# EAGLE design SHY-BOTTOM (EAGLE 9.5.1)
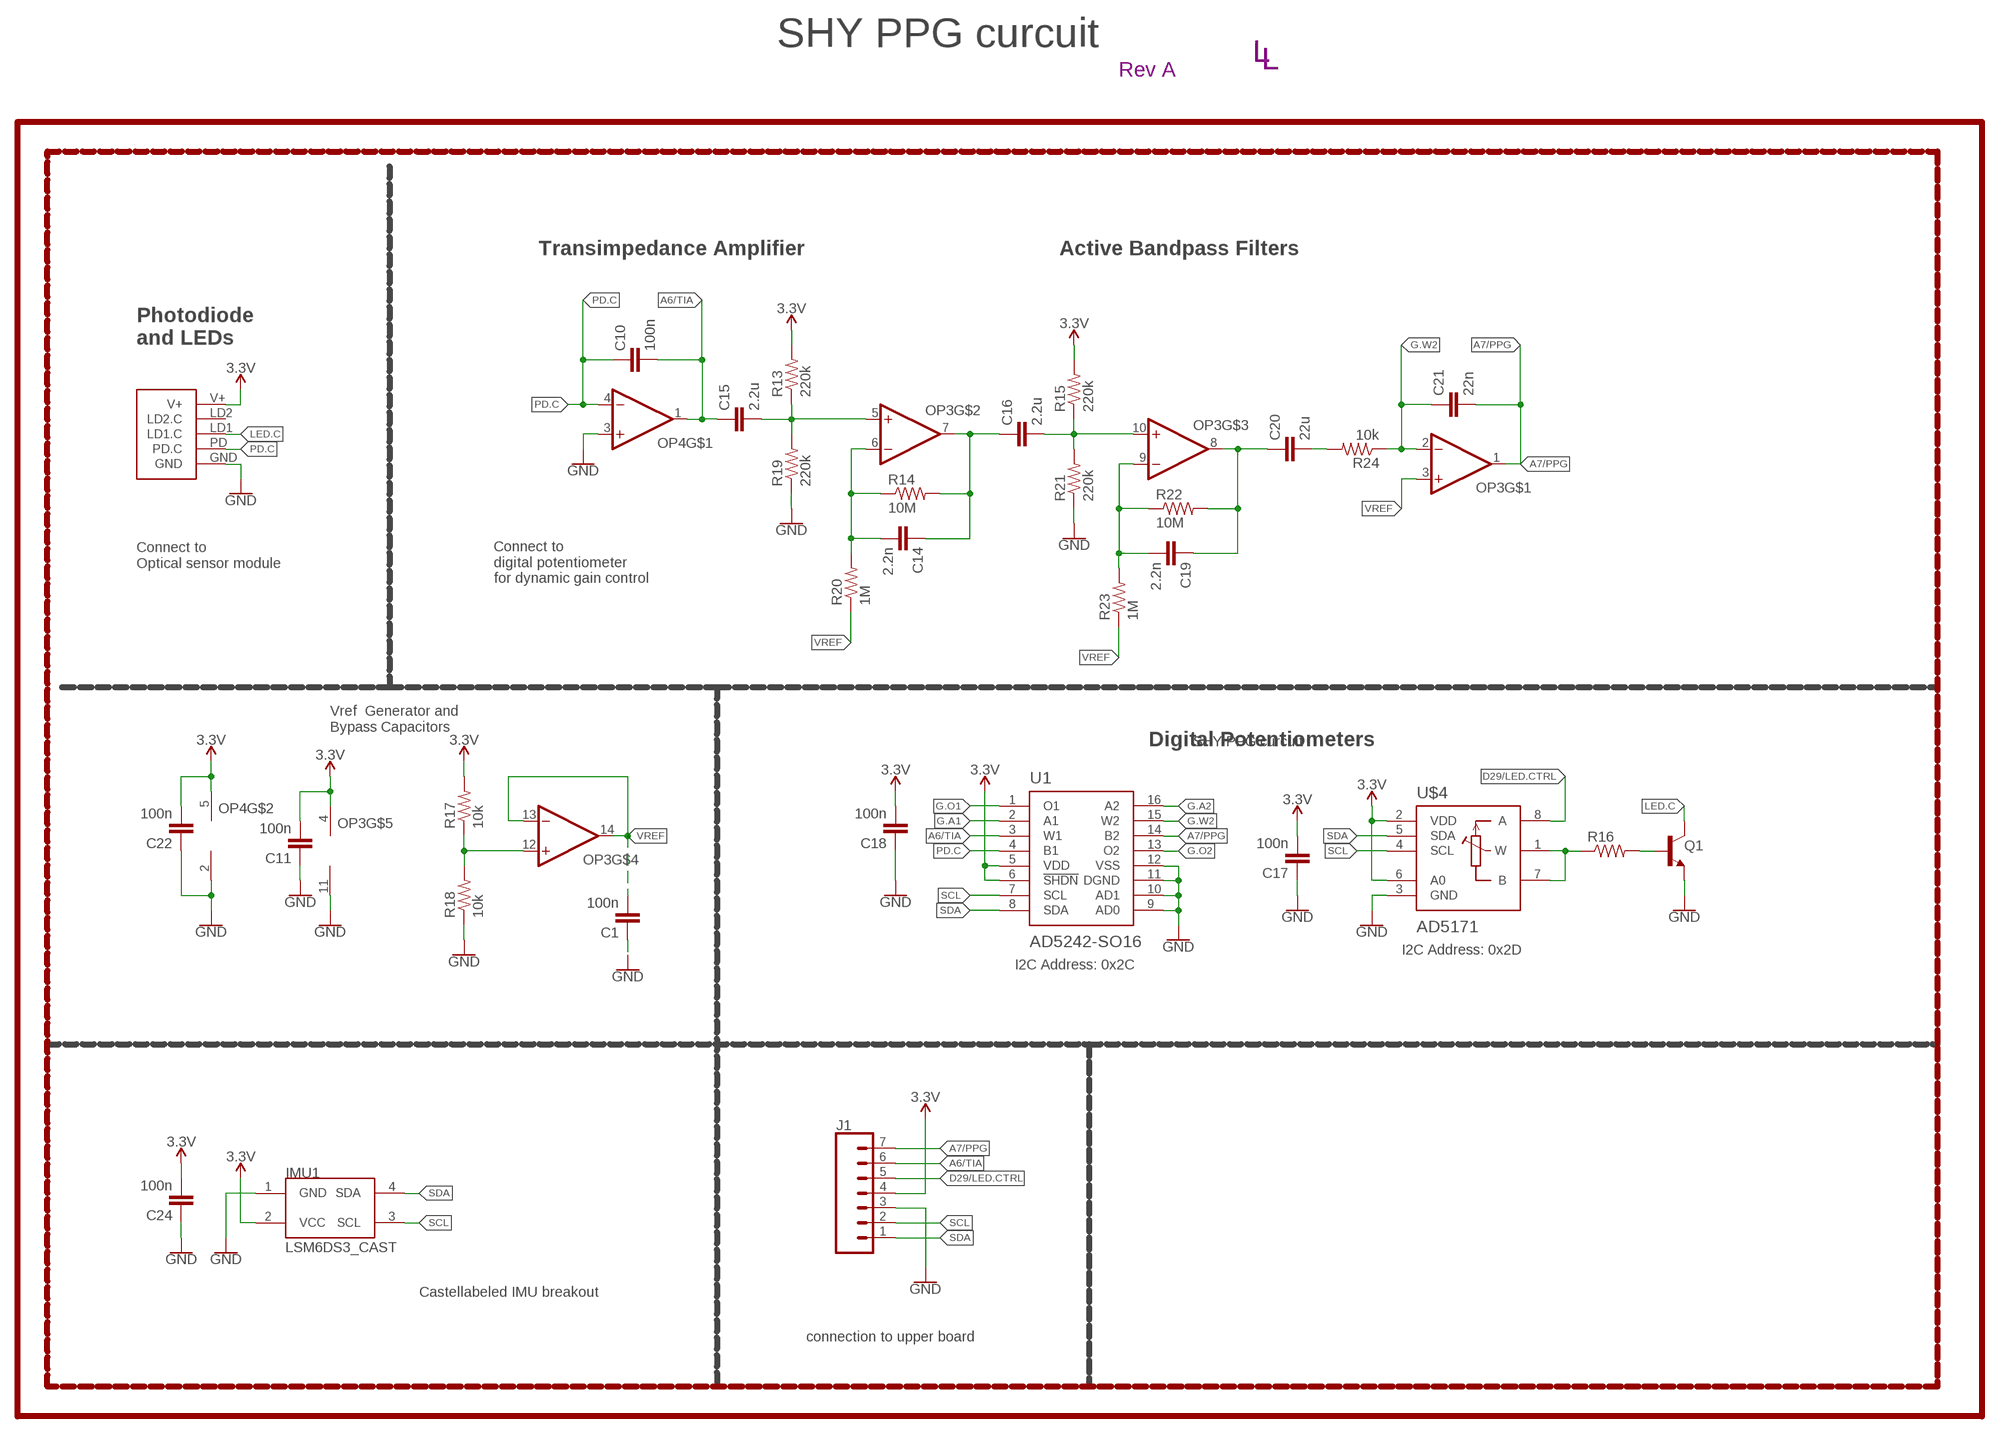
[diagram p0: schematic, sheet 1]

## Parts
C1  100n  CAPACITOR0603  [C0603]
C10  100n  CAPACITOR0603  [C0603]
C11  100n  CAPACITOR0603  [C0603]
C14  2.2n  CAPACITOR0603  [C0603]
C15  2.2u  CAPACITOR0603  [C0603]
C16  2.2u  CAPACITOR0603  [C0603]
C17  100n  CAPACITOR0603  [C0603]
C18  100n  CAPACITOR0603  [C0603]
C19  2.2n  CAPACITOR0603  [C0603]
C20  22u  CAPACITOR0603  [C0603]
C21  22n  CAPACITOR0603  [C0603]
C22  100n  CAPACITOR0603  [C0603]
C24  100n  CAPACITOR0603  [C0603]
IMU1  LSM6DS3_CAST  [LSM6DS3_CAST]
J1  CONN_07-1.27MM  [1X07_1.27MM]
LOGO1  REVISION.A  [REV.A]
LOGO2  LINNES.LAB.LOGO  [LINNES.LAB.LOGO]
OP3  OP-QUAD-SO14  [SO14]
OP4  OP-SINGLEOT  [SOT23-5]
Q1  NPN-GENERIC  [SOT23-3]
R13  220k  RESISTOR0603  [R0603]
R14  10M  RESISTOR0603  [R0603]
R15  220k  RESISTOR0603  [R0603]
R16  RESISTOR0603  [R0603]
R17  10k  RESISTOR0402  [R0402]
R18  10k  RESISTOR0402  [R0402]
R19  220k  RESISTOR0603  [R0603]
R20  1M  RESISTOR0603  [R0603]
R21  220k  RESISTOR0603  [R0603]
R22  10M  RESISTOR0603  [R0603]
R23  1M  RESISTOR0603  [R0603]
R24  10k  RESISTOR0603  [R0603]
U1  AD5242-SO16  [SO16]
U$3  PPG.MODULE.2  [PPG.MODULE.2]
U$4  AD5171  [SOT-23-8]

## Nets
3.3V: C11.2 C17.2 C18.2 C22.2 C24.2 IMU1.2(VCC) J1.4 OP3.4(V+) OP4.5(V+) R13.2 R15.2 R17.2 U1.5(VDD) U1.6(!SHDN) U$3.V+ U$4.2(VDD) U$4.6(A0)
A6/TIA: C10.2 C15.1 J1.6 OP4.1(OUT) U1.3(W1)
A7/PPG: C21.2 J1.7 OP3.1(OUT) U1.14(B2)
D29/LED.CTRL: J1.5 U$4.8(A)
G.A1: U1.2(A1)
G.A2: U1.16(A2)
G.O1: U1.1(O1)
G.O2: U1.13(O2)
G.W2: C21.1 OP3.2(-IN) R24.1 U1.15(W2)
GND: C1.1 C11.1 C17.1 C18.1 C22.1 C24.1 IMU1.1(GND) J1.3 OP3.11(V-) OP4.2(V-) OP4.3(+IN) Q1.2(E) R18.1 R19.1 R21.1 U1.9(AD0) U1.10(AD1) U1.11(DGND) U1.12(VSS) U$3.GND U$4.3(GND)
LED.C: Q1.3(C) U$3.LD1(LD1.C)
N$8: Q1.1(B) R16.2
N$9: R16.1 U$4.1(W) U$4.7(B)
N$10: OP3.12(+IN) R17.1 R18.2
N$13: C15.2 OP3.5(+IN) R13.1 R19.2
N$15: C14.2 OP3.6(-IN) R14.1 R20.2
N$16: C14.1 C16.1 OP3.7(OUT) R14.2
N$17: C16.2 OP3.10(+IN) R15.1 R21.2
N$18: C19.2 OP3.9(-IN) R22.1 R23.2
N$19: C19.1 C20.1 OP3.8(OUT) R22.2
N$20: C20.2 R24.2
PD.C: C10.1 OP4.4(-IN) U1.4(B1) U$3.PD(PD.C)
SCL: IMU1.3(SCL) J1.2 U1.7(SCL) U$4.4(SCL)
SDA: IMU1.4(SDA) J1.1 U1.8(SDA) U$4.5(SDA)
VREF: C1.2 OP3.3(+IN) OP3.13(-IN) OP3.14(OUT) R20.1 R23.1
Unconnected: U$3.LD2(LD2.C)

## Notes on the sheet
- SHY PPG curcuit
- Transimpedance Amplifier | Active Bandpass Filters
- Photodiode
  and LEDs
- Connect to 
  Optical sensor module
- Connect to 
  digital potentiometer
  for dynamic gain control
- Vref  Generator and 
  Bypass Capacitors
- Digital Potentiometers | SHY PPG curcuit
- I2C Address: 0x2D
- I2C Address: 0x2C
- Castellabeled IMU breakout
- connection to upper board

## Library data of the parts
C1 C10 C11 C14-C22 C24 = LinnesLab-Passives:CAPACITOR
IMU1 = LinnesLab-Sensors:LSM6DS3_CAST
J1 = LinnesLab-Connectors:CONN_07: Multi connection point. Often used as Generic Header-pin footprint for 0.1 inch spaced/style header connections On any of the 0.1 inch spaced packages, you can populate with these: Break Away Headers - Straight <https://www.sparkfun.com/products/116> (PRT-00116) Break Away Male Headers - Right Angle <https://www.sparkfun.com/products/553> (PRT-00553) Female Headers <https://www.sparkfun.com/products/115> (PRT-00115) Break Away Headers - Machine Pin <https://www.sparkfun.com/products/117> (PRT-00117) Break Away Female Headers - Swiss Machine Pin <https://www.sparkfun.com/products/743> (PRT-00743) For SCREWTERMINALS and SPRING TERMINALS visit here: Screw Terimnals on SparkFun.com <https://www.sparkfun.com/search/results?term=Screw+Terminals> (5mm/3.5mm/2.54mm spacing) This device is also useful as a general connection point to wire up your design to another part of your project. Our various solder wires solder well into these plated through hole pads. Hook-Up Wire - Assortment (Stranded, 22 AWG) <https://www.sparkfun.com/products/11375> (PRT-11375) Hook-Up Wire - Assortment (Solid Core, 22 AWG) <https://www.sparkfun.com/products/11367> (PRT-11367) View the entire wire category on our website here <https://www.sparkfun.com/categories/141> Special notes: Molex polarized connector foot print use with SKU : PRT-08231 with associated crimp pins and housings. 1MM SMD Version SKU: PRT-10208 NOTES ON THE VARIANTS LOCK and LOCK_LONGPADS... This footprint was designed to help hold the alignment of a through-hole component (i.e. 6-pin header) while soldering it into place. You may notice that each hole has been shifted either up or down by 0.005 of an inch from it's more standard position (which is a perfectly straight line). This slight alteration caused the pins (the squares in the middle) to touch the edges of the holes. Because they are alternating, it causes a "brace" to hold the component in place. 0.005 has proven to be the perfect amount of "off-center" position when using our standard breakaway headers. Although looks a little odd when you look at the bare footprint, once you have a header in there, the alteration is very hard to notice. Also,if you push a header all the way into place, it is covered up entirely on the bottom side.
LOGO1 = LinnesLab-Logos:REVISION.A
LOGO2 = LinnesLab-Logos:LINNES.LAB.LOGO
OP3 = LinnesLab-AnalogIC:OP-QUAD: General symbol and footprints for Quad Op Amps. Use with any standard general purpose op amp.
OP4 = LinnesLab-AnalogIC:OP-SINGLE: Single Op Amp 2.7V to 6.0V Single Supply CMOS Source: http://ww1.microchip.com/downloads/en/DeviceDoc/21314g.pdf
Q1 = LinnesLab-DiscreteSemi:NPN
R13-R24 = LinnesLab-Passives:RESISTOR
U1 = LinnesLab-DigitalIC:AD5242
U$3 = LinnesLab-Connectors:PPG.MODULE.2: Digi-Key Part Number: S9014E-50-ND Manufacturer Part Number: GRPB501VWVN-RC Description: 1mm insulation height 0.05in pitch 50 positions
U$4 = LinnesLab-DigitalIC:AD5171

## Board
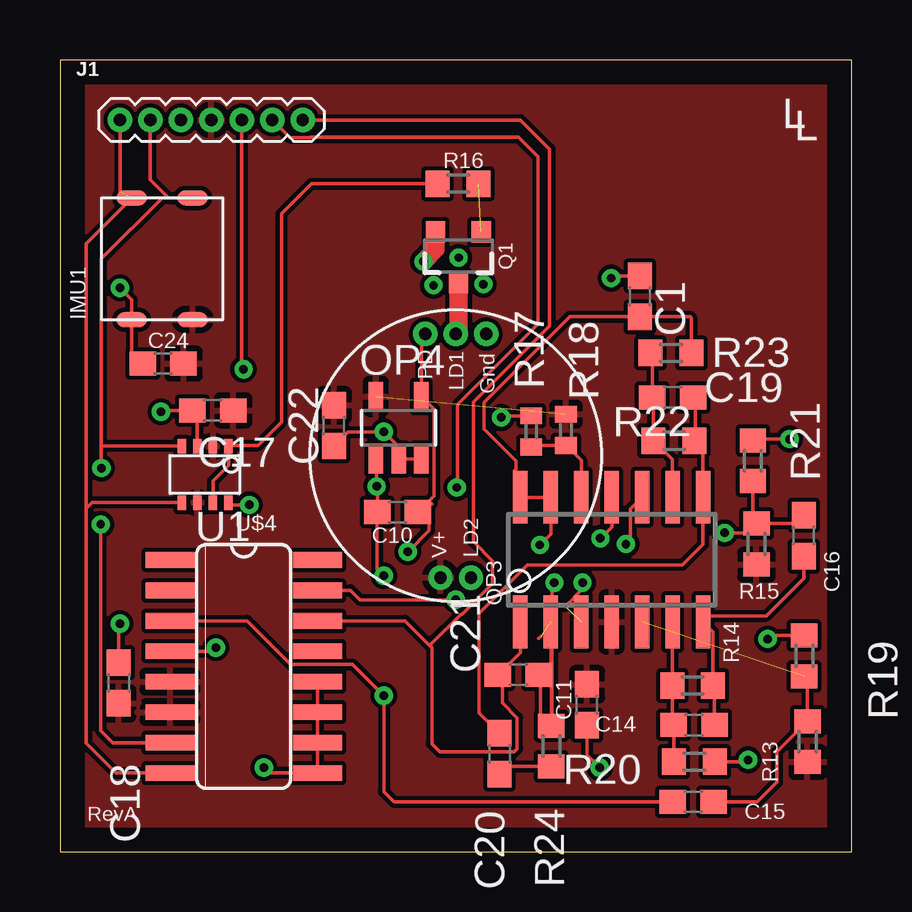
[diagram p1: board, top side]
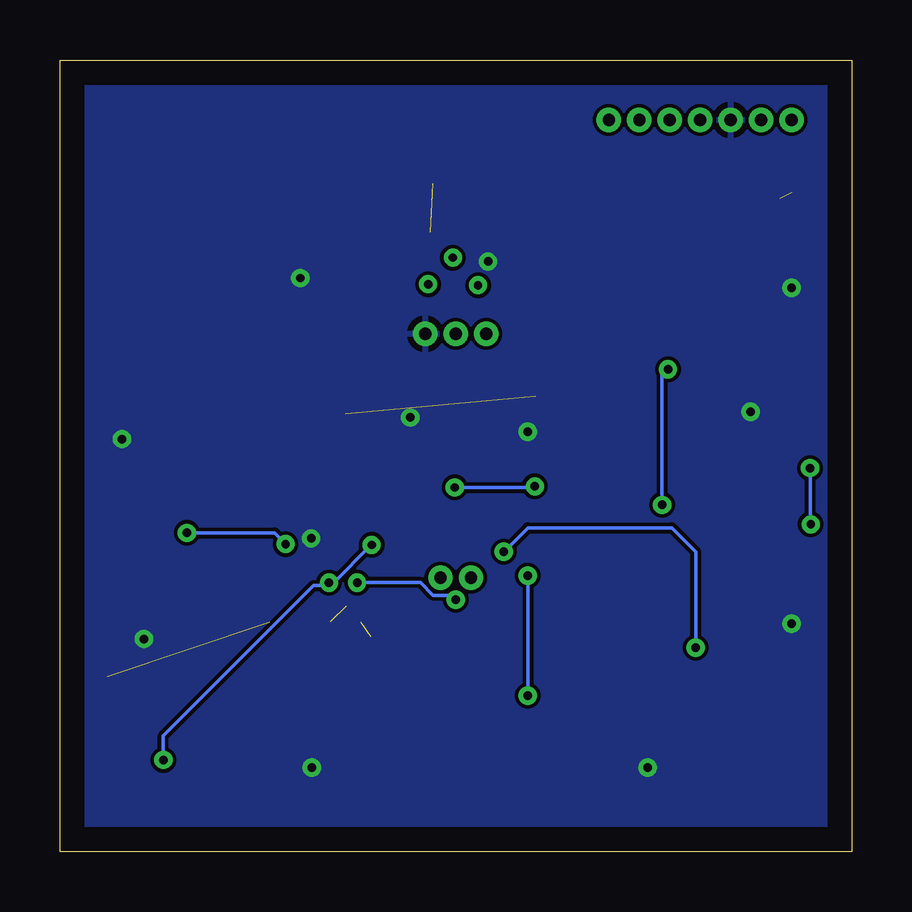
[diagram p2: board, bottom side, seen from below]

Size 33 x 33 mm. Coordinates in mm from the lower left corner, seen from the top.
Outline: 0,0 33,0 33,33 0,33 0,0
Copper layers (1*16): Top 0.035mm / dielectric 1.5mm / Bottom 0.035mm
Design rules "default": minimum track width 6mil, minimum drill 0.35mm, track to track 6mil, track to pad 6mil, pad to pad 6mil, via to via 6mil, smd to smd 6mil, copper to edge 40mil, drill to drill 6mil, minimum pad ring 10mil, minimum via ring 8mil, stop-mask expansion 4mil, vias tented up to drill 0mil, thermal gap 10mil

### Footprints (pad centres in the part's own frame; a part is rotated, then mirrored left to right if it is on the bottom)
C0603 = smd 1.1 x 1: 1 -0.85,0; 2 0.85,0
LSM6DS3_CAST = smd 0.635 x 1.27: 1 -2.54,1.27; 2 -2.54,-1.27; 3 2.54,-1.27; 4 2.54,1.27
1X07_1.27MM = drill 0.508 pad 1: 1 0,0; 2 1.27,0; 3 2.54,0; 4 3.81,0; 5 5.08,0; 6 6.35,0; 7 7.62,0
SO14 = smd 0.6 x 2.2: 1 -3.81,-2.6; 2 -2.54,-2.6; 3 -1.27,-2.6; 4 0,-2.6; 5 1.27,-2.6; 6 2.54,-2.6; 7 3.81,-2.6; 8 3.81,2.6; 9 2.54,2.6; 10 1.27,2.6; 11 0,2.6; 12 -1.27,2.6; 13 -2.54,2.6; 14 -3.81,2.6
SOT23-5 = smd 0.6 x 1.2: 1 -0.95,-1.306; 2 0,-1.306; 3 0.95,-1.306; 4 0.95,1.306; 5 -0.95,1.306
SOT23-3 = smd 0.8 x 0.9: 1 -0.95,-1; 2 0.95,-1; 3 0,1.1
R0603 = smd 1 x 1.1: 1 -0.85,0; 2 0.85,0
R0402 = smd 0.7 x 0.9: 1 -0.65,0; 2 0.65,0
SO16 = smd 0.66 x 2.032: 1 -4.445,-3.073; 2 -3.175,-3.073; 3 -1.905,-3.073; 4 -0.635,-3.073; 5 0.635,-3.073; 6 1.905,-3.073; 7 3.175,-3.073; 8 4.445,-3.073; 9 4.445,3.073; 10 3.175,3.073; 11 1.905,3.073; 12 0.635,3.073; 13 -0.635,3.073; 14 -1.905,3.073; 15 -3.175,3.073; 16 -4.445,3.073
PPG.MODULE.2 = drill 0.508 pad 0.94: GND 1.27,5.08; LD1 0,5.08; LD2 0.635,-5.08; PD -1.27,5.08; V+ -0.635,-5.08
SOT-23-8 = smd 0.35 x 0.6: 1 -0.991,-1.176; 2 -0.341,-1.176; 3 0.309,-1.176; 4 0.959,-1.176; 5 0.959,1.176; 6 0.309,1.176; 7 -0.341,1.176; 8 -0.991,1.176

### Placement (x,y rotation side)
C1  24.17,23.15 270 top
C10  14.07,14.15 180 top
C11  21.97,6.13 90 top
C14  26.43,5.28 180 top
C15  26.4,2.07 0 top
C16  31,13.17 90 top
C17  6.37,18.39 0 top
C18  2.44,7.03 270 top
C19  25.55,18.94 180 top
C20  18.33,4.08 270 top
C21  19.11,7.37 180 top
C22  11.42,17.76 90 top
C24  4.3,20.34 0 top
IMU1  4.26,24.71 90 top
J1  2.5,30.5 0 top
LOGO1  1.14,1.27 0 top
LOGO2  30.1,30.14 0 top
OP3  23,12.17 0 top
OP4  14.12,17.67 0 top
Q1  16.61,24.83 180 top
R13  31.17,4.59 270 top
R14  26.37,6.92 0 top
R15  29.04,12.82 270 top
R16  16.6,27.84 0 top
R17  21.09,17.58 90 top
R18  19.65,17.51 270 top
R19  31.02,8.16 270 top
R20  26.44,3.74 180 top
R21  28.89,16.29 270 top
R22  25.6,17.12 0 top
R23  25.47,20.79 180 top
R24  20.49,4.4 270 top
U1  7.66,7.72 270 top
U$3  16.5,16.5 0 top
U$4  6.04,15.72 180 top

### Tracks (layer width: path | path; a pad name or v marks a point on that pad's centre or on a via)
3.3V  (1 unrouted)
  Top 0.152: 3.59,5.81 U1.6
  pour Top (isolate 0.178): 1.03,32.12 32.09,32.12 32.09,0.88 0.88,0.88 0.88,32.2
A6/TIA  (via drill 0.35)
  Top 0.152: OP4.1 13.2,16.33 v13.2,15.22 13.24,15.18 13.24,14.17 C10.2 13.22,11.78 v13.5,11.5 | C15.1 13.93,2.07 13.5,2.5 v13.5,6.5 12.21,7.79 9.62,7.79 7.8,9.62 U1.3 | v16.54,15.18 16.57,15.21 16.57,18.63 19.94,21.99 19.94,28.96 19.11,29.79 10.45,29.79 10.43,29.76 9.59,29.76 J1.6
  Bottom 0.152: v13.5,11.5 v13.5,6.5 | v16.54,15.18 13.25,15.18 v13.2,15.22
A7/PPG
  Top 0.152: OP3.1 19.19,8.31 18.44,7.56 | 18.44,7.56 C21.2 | 11.38,9.62 U1.14 14.38,9.62 15.47,8.53 | 18.44,7.56 18.44,6.19 19.06,5.58 19.06,4.29 18.92,4.15 15.85,4.15 15.5,4.5 15.5,8.5 15.47,8.53 | J1.7 19.19,30.5 20.41,29.29 20.41,21.9 17.24,18.73 17.24,12.93 18.04,12.12 18.04,11.18 16.75,9.89 16.71,9.89 15.47,8.65 15.47,8.53
D29/LED.CTRL  (via drill 0.35)
  Top 0.152: J1.5 7.58,20.17 v7.65,20.1 | v7.9,14.45 7.12,14.45 U$4.8
  Bottom 0.152: v7.65,20.1 7.9,19.86 v7.9,14.45
G.W2  (via drill 0.35)  (1 unrouted)
  Top 0.152: 19.96,8.89 20.04,8.97 | 20.46,9.74 OP3.2 20.46,7.88 C21.1 | C21.1 20.03,7.44 20.03,4.76 20.5,5.24 20.5,11.1 v20.61,11.21 | C21.1 20.49,6.84 R24.1 | 11.11,10.89 U1.15 12.11,10.89 12.5,10.5 v16.5,10.5
  Bottom 0.152: v20.61,11.21 17.97,11.21 17.44,10.68 16.68,10.68 v16.5,10.5
GND  (via drill 0.35)
  Top 0.152: R18.1 18.39,18.16 v18.39,18.1 | OP3.11 23,13.53 v22.52,13.06 | v30.42,17.2 29.35,17.2 29.29,17.14 R21.1 | v29.5,8.86 29.65,9.01 R19.1 | C11.1 21.97,4.03 v22.5,3.5 | C22.1 12.02,17.5 v13.5,17.5 14.12,16.88 OP4.2 OP4.3 | U1.12 U1.11 U1.10 U1.9 8.73,3.27 v8.5,3.5 | v2.5,9.5 2.44,9.44 C18.1 | v2.5,23.5 2.99,23.01 IMU1.1 2.99,20.8 C24.1 | U$4.3 5.73,18.18 C17.1 4.27,18.39 v4.21,18.33 | C1.1 23.07,24 v22.98,23.91
  Top 0.762: Q1.2 15.66,25.11 v15.15,24.6
  pour Bottom: 0.8,32.23 32.2,32.23 32.2,0.82 0.8,0.82
LED.C
  Top 0.762: Q1.3 16.61,21.69 U$3.LD1
N$3  (via drill 0.35)
  other vias: 15.57,23.61
N$4  (via drill 0.35)
  other vias: 16.62,24.76
N$5  (via drill 0.35)
  other vias: 17.65,23.65
N$8  (1 unrouted)
N$9
  Top 0.152: R16.1 10.48,27.84 9.23,26.59 9.23,17.91 8.26,16.93 7.06,16.93 U$4.1 7.03,16.09 6.38,15.44 U$4.7
N$10
  Top 0.152: R18.2 19.72,16.93 R17.1 21.73,16.29 OP3.12
N$13  (1 unrouted)
  Top 0.152: R19.2 31.17,7.16 R13.1 29.89,4.16 29.89,2.89 29.07,2.07 C15.2
N$15
  Top 0.152: OP3.6 25.52,9.55 R14.1 25.52,5.34 C14.2 25.59,5.26 R20.2
N$16
  Top 0.152: C14.1 27.28,6.86 R14.2 27.22,9.16 OP3.7 27.07,9.83 29.44,9.83 31,11.39 C16.1
N$17  (via drill 0.35)
  Top 0.152: R15.1 28.64,13.27 v27.7,13.27 | v27.7,13.27 27.67,13.27 | v27.7,13.27 v27.71,13.28 | v23.59,12.82 23.78,13.01 23.78,14.28 OP3.10 | C16.2 30.65,13.67 R15.1 | R21.2 28.89,13.82 R15.1
  Bottom 0.152: v27.71,13.28 24.06,13.28 v23.59,12.82
N$18
  Top 0.152: OP3.9 25.54,16.33 R22.1 24.75,18.88 C19.2 24.7,20.71 R23.2
N$19
  Top 0.152: C19.1 26.5,18.83 26.5,17.18 R22.2 26.81,16.76 OP3.8 26.81,12.81 25.95,11.96 19.5,11.96 17.48,9.93 17.48,5.78 C20.1
N$20
  Top 0.152: C20.2 18.64,3.55 R24.2
PD.C  (via drill 0.35)
  Top 0.152: U$3.PD 15.07,21.42 OP4.4 15.59,18.45 15.59,14.82 15.39,14.61 | 15.5,14.5 15.27,14.5 C10.1 15.39,14.61 | U1.4 6.35,8.35 v6.5,8.5 | v14.5,12.5 15.39,13.39 15.39,14.61
  Bottom 0.152: v6.5,8.5 6.5,12.5 7.5,13.5 13.5,13.5 v14.5,12.5
SCL  (via drill 0.35)
  Top 0.152: J1.2 3.77,28.01 4.53,27.25 IMU1.3 4.26,27.25 1.73,24.72 1.73,16.92 | U1.7 2.19,4.54 1.7,5.03 v1.7,13.64 | v1.73,15.99 1.73,16.92 | U$4.4 1.75,16.9 1.73,16.92
  Bottom 0.152: v1.7,13.64 1.73,13.67 v1.73,15.99
SDA  (1 unrouted)
  Top 0.152: J1.1 2.5,27.5 | IMU1.4 1.09,25.35 1.09,14.3 | 1.09,14.3 1.09,4.5 2.33,3.27 U1.8 | U$4.5 1.34,14.54 1.09,14.3
VREF  (via drill 0.35)  (1 unrouted)
  Top 0.152: OP3.14 OP3.13 20.46,13.24 v20.01,12.78 | OP3.14 19.19,15.1 18.95,15.33 18.95,15.88 | OP3.14 19.01,14.95 19.01,16.29 17.67,17.62 17.67,18.72 21.25,22.3 C1.2 26.27,22.3 26.32,22.25 R23.1 | R20.1 28.61,3.74 v28.69,3.82 | v21.79,11.21 21.79,10.95 21.07,10.23
  Bottom 0.152: v28.69,3.82 28.69,4.83 22.43,11.09 21.91,11.09 v21.79,11.21 21.6,11.21 20.03,12.78 v20.01,12.78